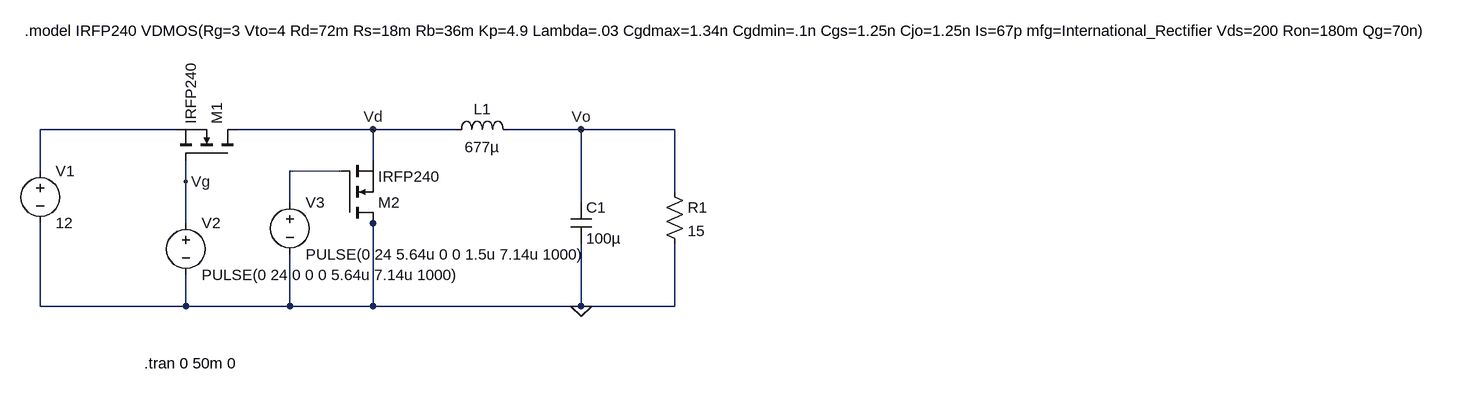
[diagram p0: schematic Regulador_buck (1).asc]
Regulador_buck (1).asc, the LTspice schematic file:
Version 4
SHEET 1 2392 680
WIRE 240 48 32 48
WIRE 544 48 336 48
WIRE 672 48 544 48
WIRE 864 48 752 48
WIRE 1008 48 864 48
WIRE 544 96 544 48
WIRE 32 112 32 48
WIRE 496 112 416 112
WIRE 256 128 256 96
WIRE 1008 144 1008 48
WIRE 416 160 416 112
WIRE 864 160 864 48
WIRE 256 192 256 128
WIRE 544 192 544 176
WIRE 32 320 32 192
WIRE 256 320 256 272
WIRE 256 320 32 320
WIRE 416 320 416 240
WIRE 416 320 256 320
WIRE 544 320 544 192
WIRE 544 320 416 320
WIRE 864 320 864 224
WIRE 864 320 544 320
WIRE 1008 320 1008 224
WIRE 1008 320 864 320
FLAG 864 320 0
FLAG 864 48 Vo
FLAG 256 128 Vg
FLAG 544 48 Vd
DATAFLAG 432 112 ""
SYMBOL voltage 32 96 R0
WINDOW 123 0 0 Left 0
WINDOW 39 0 0 Left 0
SYMATTR InstName V1
SYMATTR Value 12
SYMBOL res 992 128 R0
SYMATTR InstName R1
SYMATTR Value 15
SYMBOL voltage 256 176 R0
WINDOW 123 0 0 Left 0
WINDOW 39 0 0 Left 0
SYMATTR InstName V2
SYMATTR Value PULSE(0 24 0 0 0 5.64u 7.14u 1000)
SYMBOL voltage 416 144 R0
WINDOW 123 0 0 Left 0
WINDOW 39 0 0 Left 0
SYMATTR InstName V3
SYMATTR Value PULSE(0 24 5.64u 0 0 1.5u 7.14u 1000)
SYMBOL cap 848 160 R0
SYMATTR InstName C1
SYMATTR Value 100µ
SYMBOL ind 656 64 R270
WINDOW 0 32 56 VTop 2
WINDOW 3 5 56 VBottom 2
SYMATTR InstName L1
SYMATTR Value 677µ
SYMBOL nmos 336 96 M270
SYMATTR InstName M1
SYMATTR Value IRFP240
SYMBOL nmos 496 192 M180
SYMATTR InstName M2
SYMATTR Value IRFP240
TEXT 192 408 Left 2 !.tran 0 50m 0
TEXT 8 -104 Left 2 !.model IRFP240 VDMOS(Rg=3 Vto=4 Rd=72m Rs=18m Rb=36m Kp=4.9 Lambda=.03 Cgdmax=1.34n Cgdmin=.1n Cgs=1.25n Cjo=1.25n Is=67p mfg=International_Rectifier Vds=200 Ron=180m Qg=70n)

The netlist it stands for:
* Regulador_buck (1).asc
V1 N001 0 12
R1 Vo 0 15
V2 Vg 0 PULSE(0 24 0 0 0 5.64u 7.14u 1000)
V3 N002 0 PULSE(0 24 5.64u 0 0 1.5u 7.14u 1000)
C1 Vo 0 100µ
L1 Vd Vo 677µ
M1 Vd Vg N001 N001 IRFP240
M2 0 N002 Vd Vd IRFP240
.model NMOS NMOS
.model PMOS PMOS
.lib standard.mos
.tran 0 50m 0
.model IRFP240 VDMOS(Rg=3 Vto=4 Rd=72m Rs=18m Rb=36m Kp=4.9 Lambda=.03 Cgdmax=1.34n Cgdmin=.1n Cgs=1.25n Cjo=1.25n Is=67p mfg=International_Rectifier Vds=200 Ron=180m Qg=70n)
.backanno
.end